# EAGLE design vcu (EAGLE 9.5.2)
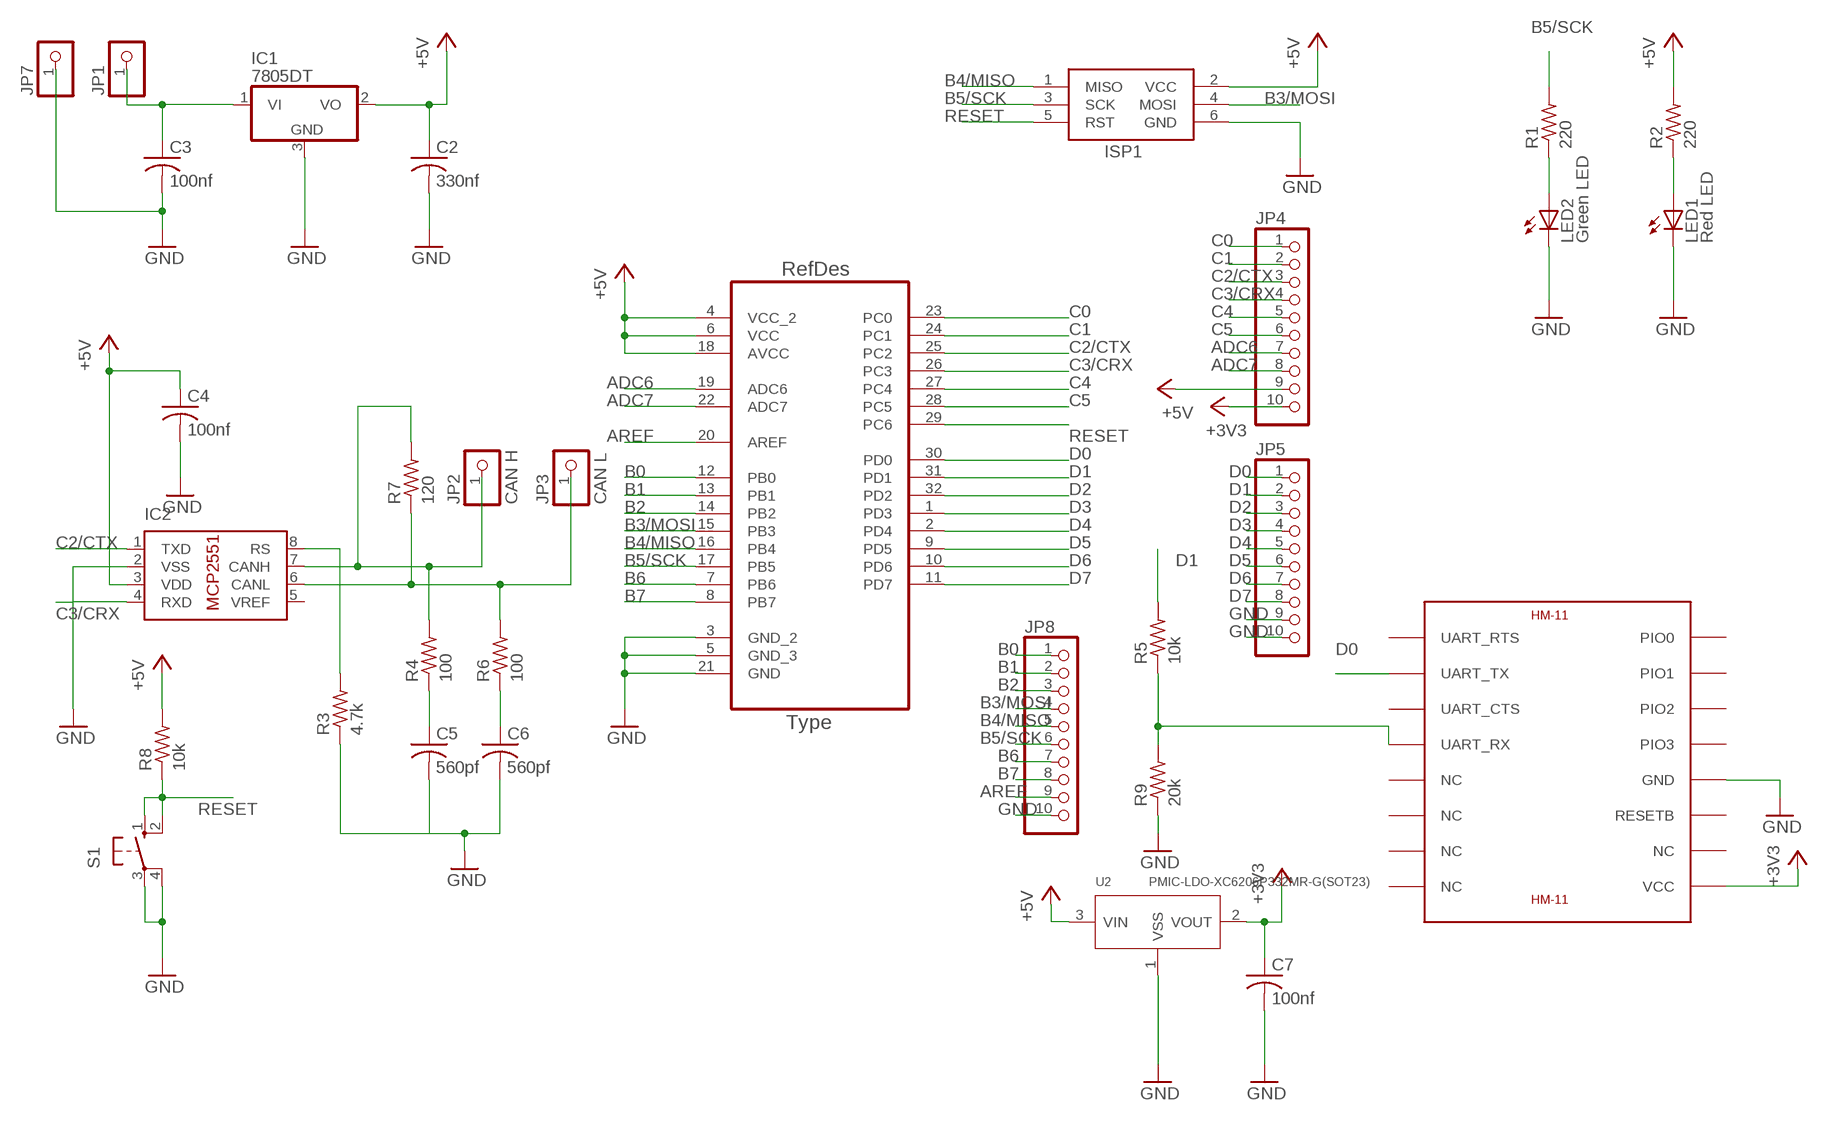
[diagram p0: schematic, sheet 1]

## Parts
C2  330nf  C-USC0402  [C0402]
C3  100nf  C-USC0402  [C0402]
C4  100nf  C-USC0402  [C0402]
C5  560pf  C-USC0402  [C0402]
C6  560pf  C-USC0402  [C0402]
C7  100nf  C-USC0402  [C0402]
IC1  7805DT  [TO252]
IC2  MCP2551/SN  [SO08]
ISP1  AVRISP-6  [AVRISP]
JP1  PINHD-1X1CB  [1X01-CLEANBIG]
JP2  CAN H  PINHD-1X1CB  [1X01-CLEANBIG]
JP3  CAN L  PINHD-1X1CB  [1X01-CLEANBIG]
JP4  PINHD-1X10  [1X10]
JP5  PINHD-1X10  [1X10]
JP7  PINHD-1X1CB  [1X01-CLEANBIG]
JP8  PINHD-1X10  [1X10]
LED1  Red LED  LED0603  [LED-0603]
LED2  Green LED  LED0603  [LED-0603]
R1  220  R-US_M0805  [M0805]
R2  220  R-US_M0805  [M0805]
R3  4.7k  R-US_M0805  [M0805]
R4  100  R-US_M0805  [M0805]
R5  10k  R-US_M0805  [M0805]
R6  100  R-US_M0805  [M0805]
R7  120  R-US_M0805  [M0805]
R8  10k  R-US_M0805  [M0805]
R9  20k  R-US_M0805  [M0805]
S1  10-XX  [B3F-10XX]
U1  ATMEGA328P-AU  [QFP80P900X900X120-32N]
U2  PMIC-LDO-XC6206P332MR-G(SOT23)  [SOT-23]
U$1  HM-11  [HM-11]

## Nets
+3V3: C7.1 JP4.10 U2.2(VOUT) U$1.VCC
+5V: C2.1 C4.1 IC1.2(VO) IC2.3(VDD) ISP1.2(VCC) JP4.9 R2.2 R8.2 U1.4(VCC_2) U1.6(VCC) U1.18(AVCC) U2.3(VIN)
ADC6: JP4.7 U1.19(ADC6)
ADC7: JP4.8 U1.22(ADC7)
AREF: JP8.9 U1.20(AREF)
B0: JP8.1 U1.12(PB0)
B1: JP8.2 U1.13(PB1)
B2: JP8.3 U1.14(PB2)
B3/MOSI: ISP1.4(MOSI) JP8.4 U1.15(PB3)
B4/MISO: ISP1.1(MISO) JP8.5 U1.16(PB4)
B5/SCK: ISP1.3(SCK) JP8.6 R1.2 U1.17(PB5)
B6: JP8.7 U1.7(PB6)
B7: JP8.8 U1.8(PB7)
C0: JP4.1 U1.23(PC0)
C1: JP4.2 U1.24(PC1)
C2/CTX: IC2.1(TXD) JP4.3 U1.25(PC2)
C3/CRX: IC2.4(RXD) JP4.4 U1.26(PC3)
C4: JP4.5 U1.27(PC4)
C5: JP4.6 U1.28(PC5)
D0: JP5.1 U1.30(PD0) U$1.UART_TX
D1: JP5.2 R5.2 U1.31(PD1)
D2: JP5.3 U1.32(PD2)
D3: JP5.4 U1.1(PD3)
D4: JP5.5 U1.2(PD4)
D5: JP5.6 U1.9(PD5)
D6: JP5.7 U1.10(PD6)
D7: JP5.8 U1.11(PD7)
GND: C2.2 C3.2 C4.2 C5.2 C6.2 C7.2 IC1.3(GND) IC2.2(VSS) ISP1.6(GND) JP5.9 JP5.10 JP7.1 JP8.10 LED1.C LED2.C R3.1 R9.1 S1.3(P) S1.4(P1) U1.3(GND_2) U1.5(GND_3) U1.21(GND) U2.1(VSS) U$1.GND
N$2: C3.1 IC1.1(VI) JP1.1
N$3: R5.1 R9.2 U$1.UART_RX
N$8: LED1.A R2.1
N$9: LED2.A R1.1
N$39: IC2.7(CANH) JP2.1 R4.2 R7.2
N$40: IC2.6(CANL) JP3.1 R6.2 R7.1
N$41: C6.1 R6.1
N$42: C5.1 R4.1
N$43: IC2.8(RS) R3.2
RESET: ISP1.5(RST) R8.1 S1.1(S) S1.2(S1) U1.29(PC6)
Unconnected: IC2.5(VREF) U$1.NC@5(NC) U$1.NC@6(NC) U$1.NC@7(NC) U$1.NC@8(NC) U$1.NC@10(NC) U$1.PIO0 U$1.PIO1 U$1.PIO2 U$1.PIO3 U$1.RESETB U$1.UART_CTS U$1.UART_RTS

## Library data of the parts
C2-C7 = adafruit:C-US: CAPACITOR, American symbol
IC1 = linear:78*: Positive VOLTAGE REGULATOR Source: http://cache.national.com/ds/LM/LM78L05.pdf http://www.fairchildsemi.com/ds/LM/LM7805.pdf
IC2 = microchip-dspic:MCP2551: High-Speed CAN Transceiver
ISP1 = adafruit:AVRISP: AVR ISP HEADER Standard 6 pin header for AVR programming
JP1-JP3 JP7 = adafruit:PINHD-1X1: Pin header 1x1 for 0.1" spacing With round pins
JP4 JP5 JP8 = pinhead:PINHD-1X10: PIN HEADER
LED1 LED2 = SparkFun:LED: LEDs Standard schematic elements and footprints for 5mm, 3mm, 1206, and 0603 sized LEDs. 5mm - Spark Fun Electronics SKU : COM-00529 (and others)
R1-R9 = adafruit:R-US_: RESISTOR, American symbol
S1 = switch-omron:10-XX: OMRON SWITCH; MPN: B3F-1000; OC_FARNELL: 176432; OC_NEWARK: 36M3542
U1 = Atmel-ATMEGA328P-AU:ATMEGA328P-AU; DESCRIPTION: 8-bit Microcontroller with In-System Programmable Flash; MPN: ATMEGA328P-AU; OC_FARNELL: 1715486; OC_NEWARK: 14R4631; PACKAGE: TQFP-32; SUPPLIER: Atmel
U2 = PMIC-LDO-XC6206P332MR-G_SOT23_:PMIC-LDO-XC6206P332MR-G(SOT23): 310030099; AVAILABILITY: Unavailable; DESCRIPTION: Linear Voltage Regulator IC 1 Output 200mA SOT-23; MF: Torex; MP: XC6206P332MR-G; PACKAGE: SOT-23-3 Torex; PRICE: None
U$1 = hm-11:HM-11: JNHuaMao HM-11 Bluetooth 4.0 Transceiver based on TI CC2540/CC2541

## Board
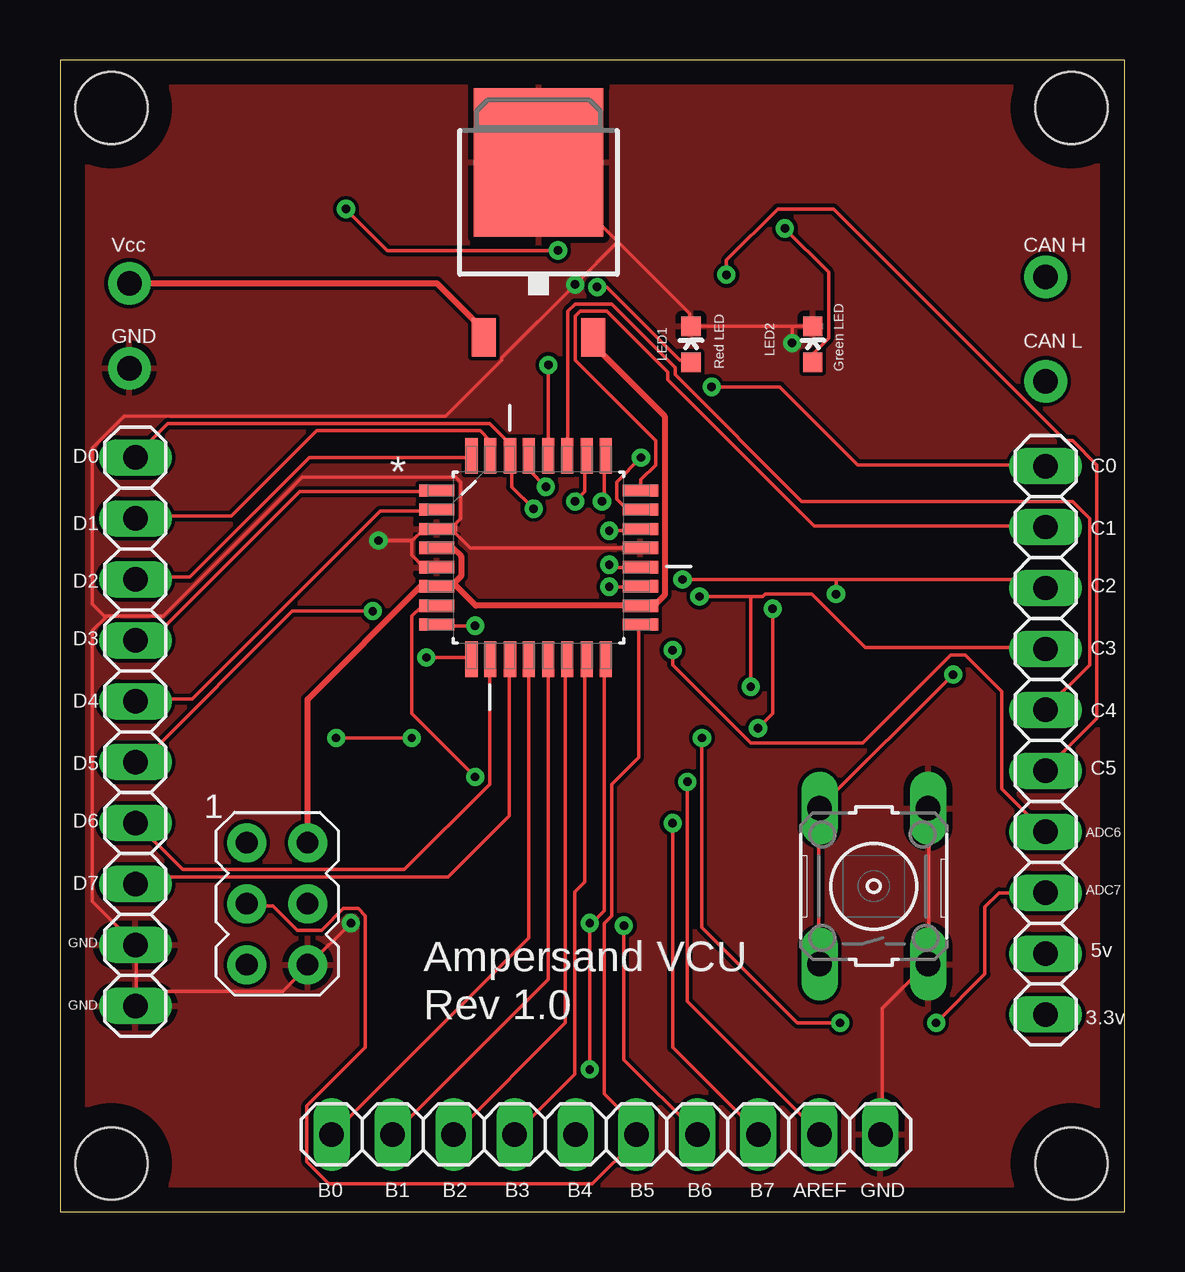
[diagram p1: board, top side]
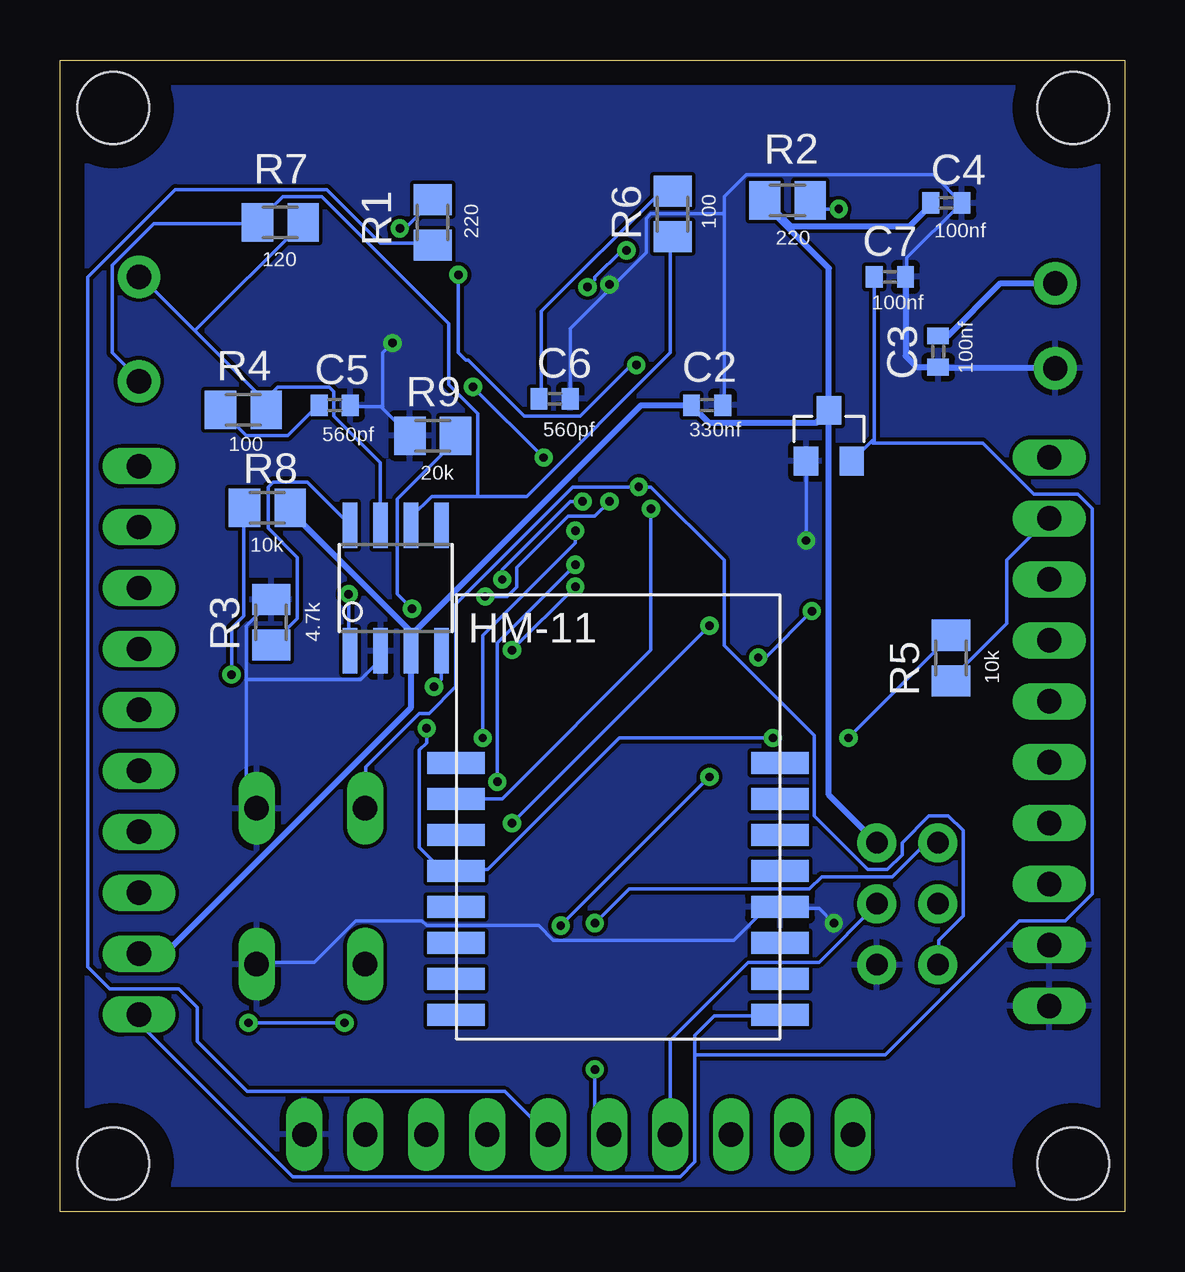
[diagram p2: board, bottom side, seen from below]

Size 44.36 x 48 mm. Coordinates in mm from the lower left corner, seen from the top.
Outline: 0,0 44.36,0 44.36,48 0,48 0,0
Copper layers (1*16): Top 0.035mm / dielectric 1.5mm / Bottom 0.035mm
Design rules "default": minimum track width 6mil, minimum drill 0.35mm, track to track 6mil, track to pad 6mil, pad to pad 6mil, via to via 6mil, smd to smd 6mil, copper to edge 40mil, drill to drill 6mil, minimum pad ring 10mil, minimum via ring 8mil, stop-mask expansion 4mil, vias tented up to drill 0mil, thermal gap 10mil
Holes 3 mm at 2.14,46 42.14,46 42.14,2 2.14,2

### Footprints (pad centres in the part's own frame; a part is rotated, then mirrored left to right if it is on the bottom)
C0402 = smd 0.7 x 0.9: 1 -0.65,0; 2 0.65,0
TO252 = smd 1 x 1.6: 1 -2.28,-4.8; 2 2.28,-4.8 | smd 5.4 x 6.2: 3 0,2.5
SO08 = smd 0.61 x 1.905: 1 -1.905,-2.616; 2 -0.635,-2.616; 3 0.635,-2.616; 4 1.905,-2.616; 5 1.905,2.616; 6 0.635,2.616; 7 -0.635,2.616; 8 -1.905,2.616
AVRISP = drill 0.9 pad 1.626: 1 -1.27,2.54; 2 1.27,2.54; 3 -1.27,0; 4 1.27,0; 5 -1.27,-2.54; 6 1.27,-2.54
1X01-CLEANBIG = drill 1.016 pad 1.778: 1 0,0
1X10 = drill 1.016 long: 1 -11.43,0; 2 -8.89,0; 3 -6.35,0; 4 -3.81,0; 5 -1.27,0; 6 1.27,0; 7 3.81,0; 8 6.35,0; 9 8.89,0; 10 11.43,0
LED-0603 = smd 0.8 x 0.8: A 0,-0.75; C 0,0.75
M0805 = smd 1.3 x 1.6: 1 -0.95,0; 2 0.95,0
B3F-10XX = drill 1.016 long: 1 -3.251,2.261; 2 3.251,2.261; 3 -3.251,-2.261; 4 3.251,-2.261
QFP80P900X900X120-32N = smd 1.473 x 0.508: 1 -4.242,2.794; 2 -4.242,2.007; 3 -4.242,1.194; 4 -4.242,0.406; 5 -4.242,-0.406; 6 -4.242,-1.194; 7 -4.242,-2.007; 8 -4.242,-2.794; 17 4.242,-2.794; 18 4.242,-2.007; 19 4.242,-1.194; 20 4.242,-0.406; 21 4.242,0.406; 22 4.242,1.194; 23 4.242,2.007; 24 4.242,2.794 | smd 0.508 x 1.473: 9 -2.794,-4.242; 10 -2.007,-4.242; 11 -1.194,-4.242; 12 -0.406,-4.242; 13 0.406,-4.242; 14 1.194,-4.242; 15 2.007,-4.242; 16 2.794,-4.242; 25 2.794,4.242; 26 2.007,4.242; 27 1.194,4.242; 28 0.406,4.242; 29 -0.406,4.242; 30 -1.194,4.242; 31 -2.007,4.242; 32 -2.794,4.242
SOT-23 = smd 1.016 x 1.2: 1 -0.95,-1.06; 2 0.95,-1.06; 3 0,1.06
HM-11 = smd 2.4 x 0.9: GND 6.5,0; NC@5 -7,0; NC@6 -7,-1.5; NC@7 -7,-3; NC@8 -7,-4.5; NC@10 6.5,-3; PIO0 6.5,6; PIO1 6.5,4.5; PIO2 6.5,3; PIO3 6.5,1.5; RESETB 6.5,-1.5; UART_CTS -7,3; UART_RTS -7,6; UART_RX -7,1.5; UART_TX -7,4.5; VCC 6.5,-4.5

### Placement (x,y rotation side)
C2  17.4,33.61 0 bottom
C3  7.77,35.85 270 bottom
C4  7.43,42.04 0 bottom
C5  32.91,33.61 0 bottom
C6  23.75,33.88 0 bottom
C7  9.78,38.96 0 bottom
IC1  19.94,41.23 0 top
IC2  30.37,25.99 0 bottom
ISP1  9.05,12.83 0 top
JP1  2.89,38.69 0 top
JP2  41.07,38.96 0 top
JP3  41.07,34.61 0 top
JP4  41.07,19.64 270 top
JP5  3.14,20 270 top
JP7  2.89,35.15 0 top
JP8  22.75,3.21 0 top
LED1  26.29,36.15 0 top
LED2  31.37,36.15 0 top
R1  28.83,41.23 270 bottom
R2  14.05,42.15 180 bottom
R3  35.56,24.56 270 bottom
R4  36.72,33.42 0 bottom
R5  7.24,23.07 270 bottom
R6  18.83,41.58 270 bottom
R7  35.18,41.23 0 bottom
R8  35.72,29.34 0 bottom
R9  28.83,32.34 0 bottom
S1  33.91,13.56 90 top
U1  19.94,27.26 0 top
U2  12.32,32.34 0 bottom
U$1  20.86,12.7 0 bottom

### Tracks (layer width: path | path; a pad name or v marks a point on that pad's centre or on a via)
+3V3
  Bottom 0.152: 17.91,6.53 17.91,2.06 18.52,1.45 34.67,1.45 40.97,7.75 40.97,8.16 JP4.10 | 17.91,6.53 17.91,7.35 17.09,8.16 14.45,8.16 U$1.VCC | 10.49,32.03 5.92,32.03 3.79,29.9 1.96,29.9 1.35,29.29 1.35,13.24 2.47,12.12 4.4,12.12 9.98,6.53 17.91,6.53 | 10.49,32.03 10.54,32.09 10.49,32.14 10.51,32.14 U2.2 | C7.1 10.43,32.1 10.49,32.03
+5V
  Top 0.254: ISP1.2 10.32,21.35 15.04,26.07 U1.6 | U1.6 16.52,26.07 17.33,25.25 U1.18 24.76,25.25 25.2,25.7 25.2,33.15 22.22,36.13 IC1.2 | U1.4 16.36,27.67 16.71,27.31 16.71,26.48 16.3,26.07 U1.6
  Bottom 0.254: IC2.3 29.73,24.02 20.15,33.61 C2.1 17.32,32.88 12.84,32.88 U2.3 | JP4.9 40,10.75 29.73,21.01 IC2.3 | IC2.3 29.73,24.16 34.77,29.19 R8.2 | U2.3 12.32,39.32 15,42 R2.2 13.92,41.07 8.95,41.07 8.08,41.94 C4.1 | ISP1.2 12.32,17.37 U2.3
ADC6  (via drill 0.35)
  Top 0.152: v22.89,26.04 24.11,26.04 U1.19 | v25.53,23.4 25.53,22.79 28.78,19.54 33.45,19.54 37.11,23.2 37.72,23.2 39.24,21.67 39.24,17.61 40.97,15.88 JP4.7
  Bottom 0.152: v25.53,23.4 v22.89,26.04
ADC7  (via drill 0.35)
  Top 0.152: v22.89,28.38 24.11,28.38 U1.22 | v26.75,19.74 26.75,11.84 30.72,7.86 v32.5,7.86 | JP4.8 39.13,13.29 38.54,12.7 38.54,9.9 v36.5,7.86
  Bottom 0.152: v22.89,28.38 22.89,27.87 26.75,24.01 v26.75,19.74 | v32.5,7.86 v36.5,7.86
AREF  (via drill 0.35)
  Top 0.152: U1.20 22.99,26.85 v22.89,26.95 | v26.14,17.91 26.14,8.77 31.62,3.28 JP8.9
  Bottom 0.152: v22.89,26.95 26.14,23.7 v26.14,17.91
B0
  Top 0.152: U1.12 19.53,11.41 11.41,3.28 JP8.1
B1
  Top 0.152: U1.13 20.35,9.68 13.95,3.28 JP8.2
B2
  Top 0.152: U1.14 21.06,22.99 21.06,7.85 16.49,3.28 JP8.3
B3/MOSI
  Top 0.152: U1.15 21.87,22.99 21.87,13.75 21.44,13.32 21.44,5.71 JP8.4
  Bottom 0.152: ISP1.4 10.39,12.73 12.73,10.39 15.67,10.39 18.92,7.14 18.92,3.28 JP8.4
B4/MISO  (via drill 0.35)
  Top 0.152: 22.12,11.97 22.07,11.92 v22.07,5.92 | 22.12,11.97 22.68,12.53 22.68,22.99 U1.16 | v22.07,12.02 22.12,11.97
  Bottom 0.152: v22.07,5.92 22.07,3.79 21.57,3.28 JP8.5 | v22.07,12.02 20.65,13.44 13.13,13.44 12.62,13.95 9.68,13.95 8.36,15.27 7.85,15.27 ISP1.1
B5/SCK
  Top 0.152: U1.17 24.11,24.41 24.11,18.93 22.99,17.81 22.99,12.33 22.68,12.02 22.68,4.91 24,3.59 24,3.28 JP8.6 24,3.18 24,2.98 22.17,1.15 11.2,1.15 10.29,2.06 10.29,4.4 12.73,6.84 12.73,12.33 12.42,12.63 11.81,12.63 10.9,11.72 9.88,11.72 8.87,12.73 7.85,12.73 ISP1.3
  Bottom 0.152: R1.2 28.88,40.37 31.01,40.37 33.25,42.6 39.55,42.6 43.21,38.94 43.21,10.19 42.29,9.28 39.41,9.28 38.64,8.5 38.64,7.1 36.55,5.01 25.83,5.01 24.11,3.28 JP8.6
B6  (via drill 0.35)
  Top 0.152: v17.3,18.12 14.66,20.76 14.66,24.82 15.06,25.23 15.67,25.23 U1.7 | v23.5,11.92 23.5,6.33 26.54,3.28 JP8.7
  Bottom 0.152: v23.5,11.92 v17.3,18.12
B7  (via drill 0.35)
  Top 0.152: v17.3,24.41 15.77,24.41 U1.8 | v25.53,16.19 25.53,6.84 29.08,3.28 JP8.8
  Bottom 0.152: v25.53,16.19 v17.3,24.41
C0  (via drill 0.35)
  Top 0.152: v24.21,31.43 23.19,30.41 23.19,29.7 23.6,29.29 24.11,29.29 U1.23 | v27.15,34.37 30,34.37 33.25,31.12 40.97,31.12 JP4.1
  Bottom 0.152: v27.15,34.37 v24.21,31.43
C1
  Top 0.152: U1.24 24.21,30.1 24.21,30.51 24.82,31.12 24.82,32.14 21.46,35.49 21.46,37.32 21.67,37.52 22.79,37.52 25.33,34.98 25.33,34.68 31.42,28.58 40.97,28.58 JP4.2
C2/CTX  (via drill 0.35)
  Top 0.152: v22.58,29.6 22.68,29.7 22.68,31.43 U1.25 | 32.34,26.35 40.67,26.35 40.97,26.04 JP4.3 | 32.34,26.35 v25.93,26.35 | 32.34,26.35 v32.34,25.74
  Bottom 0.152: v22.58,29.6 23.09,29.6 25.93,26.75 v25.93,26.35 | v32.34,25.74 32.34,23.4 IC2.1
C3/CRX  (via drill 0.35)
  Top 0.152: v21.46,29.6 21.87,30 21.87,31.43 U1.26 | 28.78,25.63 29.29,25.63 29.39,25.74 31.32,25.74 33.55,23.5 40.97,23.5 JP4.4 | 28.78,25.63 v26.65,25.63 | 28.78,25.63 v28.78,21.88
  Bottom 0.152: v21.46,29.6 22.07,28.99 23.19,28.99 25.33,26.85 25.33,26.04 25.73,25.63 v26.65,25.63 | v28.78,21.88 28.47,22.18 28.47,23.3 IC2.4
C4
  Top 0.152: U1.27 21.16,31.53 21.16,37.52 21.46,37.83 22.99,37.83 25.63,35.19 25.63,34.88 30.91,29.6 42.19,29.6 42.9,28.89 42.9,22.79 41.07,20.96 JP4.5
C5  (via drill 0.35)
  Top 0.152: v20.35,35.29 U1.28 | v27.76,39.05 27.76,39.66 29.9,41.79 32.23,41.79 41.89,32.14 42.19,32.14 43.21,31.12 43.21,20.55 41.07,18.42 JP4.6
  Bottom 0.152: v20.35,35.29 20.55,35.29 22.68,33.15 25.02,33.15 27.36,35.49 27.46,35.49 27.76,35.79 v27.76,39.05
D0  (via drill 0.35)
  Top 0.152: JP5.1 3.18,31.53 4.5,32.85 17.91,32.85 18.72,32.03 18.72,31.53 U1.30 18.82,31.43 18.82,30.21 v19.74,29.29
  Bottom 0.152: v19.74,29.29 19.74,23.4 25.93,17.2 27.76,17.2 U$1.UART_TX
D1
  Top 0.152: JP5.2 3.18,28.99 7.14,28.99 10.69,32.54 17.5,32.54 17.93,32.11 U1.31
  Bottom 0.152: R5.2 7.24,22.18 4.9,24.52 4.9,27.16 3.18,28.89 JP5.2
D2
  Top 0.152: U1.32 17.09,31.43 10.39,31.43 5.41,26.45 3.18,26.45 JP5.3
D3
  Top 0.152: U1.1 15.67,30 9.98,30 3.89,23.91 3.18,23.91 JP5.4
D4
  Top 0.152: U1.2 15.67,29.19 13.34,29.19 5.51,21.37 3.18,21.37 JP5.5
D5  (via drill 0.35)
  Top 0.152: v15.27,23.09 17.09,23.09 U1.9 | v13.03,25.02 9.68,25.02 3.48,18.83 3.18,18.83 JP5.6
  Bottom 0.152: v15.27,23.09 14.96,23.09 v13.03,25.02
D6
  Top 0.152: U1.10 17.91,22.99 17.91,17.81 14.35,14.26 5.11,14.26 3.18,16.19 JP5.7
D7
  Top 0.152: U1.11 18.72,22.99 18.72,16.49 16.18,13.95 3.38,13.95 3.18,13.75 JP5.8
GND  (via drill 0.35)
  Top 0.152: 30.51,36.91 31.32,36.91 LED2.C | 30.51,36.91 26.34,36.91 LED1.C 26.24,36.91 26.24,37.42 23.24,40.42 | 23.24,40.42 19.94,43.72 IC1.3 | 30.51,36.91 v30.51,36.2 | 23.24,40.42 v21.46,38.64 18.42,35.59 18.42,35.49 16.08,33.15 2.67,33.15 1.35,31.83 1.35,25.33 1.91,24.77 | JP8.10 34.27,3.28 34.27,8.46 36.09,10.29 S1.3 36.2,10.39 36.2,16.8 S1.4 | U1.5 15.16,26.85 14.66,27.36 14.66,27.94 | U1.21 17.09,27.67 16.44,28.33 | 16.44,28.33 16.38,28.38 15.77,28.38 U1.3 15.17,28.45 14.66,27.94 | 3.18,9.18 3.18,11.11 JP5.9 3.07,11.21 1.35,12.93 1.35,24.21 1.91,24.77 | 3.18,9.18 3.18,8.67 JP5.10 3.18,9.18 | v12.12,12.02 10.39,10.29 ISP1.6 10.29,10.19 9.27,9.18 3.18,9.18 | 1.91,24.77 1.96,24.82 4.29,24.82 10.09,30.61 16.49,30.61 16.69,30.41 16.69,28.89 16.49,28.68 16.49,28.38 16.44,28.33 | v13.27,27.97 14.63,27.97 14.66,27.94
  Bottom 0.152: 16.69,41.59 16.69,42.3 15.77,43.21 7.95,43.21 C4.2 6.83,41.99 9.07,39.76 9.07,39.05 C7.2 | 16.69,41.59 16.69,33.66 C2.2 | 21.41,38.49 19.94,39.96 19.94,41.38 19.74,41.59 16.69,41.59 | 21.41,38.49 23.09,36.81 23.09,33.97 C6.2 | 30.96,33.51 29.8,32.34 R9.1 | 30.96,33.51 31.01,33.56 32.23,33.56 C5.2 | v30.51,36.2 30.91,35.79 30.91,33.56 30.96,33.51 | v21.46,38.64 21.46,38.54 21.41,38.49 | 36.6,22.18 36.6,17.3 36.2,16.9 S1.4 | 36.6,22.18 36.6,24.41 35.59,25.43 R3.1 | 36.6,22.18 31.83,22.18 31.01,22.99 31.01,23.3 IC2.2 | v12.12,12.02 12.73,12.63 14.35,12.63 U$1.GND 14.45,12.63 14.96,12.63 16.28,11.31 23.8,11.31 24.41,11.92 29.08,11.92 29.29,12.12 32.03,12.12 33.76,10.39 36.09,10.39 S1.3 | U2.1 v13.27,27.97
  Bottom 0.254: JP7.1 7.72,35.15 C3.2 8.67,35.2 9.13,35.66 C7.2
  pour Top: 0.14,48 44.14,48 44.14,0 0.14,0
  pour Bottom: 0.14,48 44.14,48 44.14,0 0.14,0
N$2
  Top 0.254: IC1.1 17.66,36.73 15.7,38.69 JP1.1
  Bottom 0.254: JP1.1 5.18,38.69 7.37,36.5 C3.1
N$3  (via drill 0.35)
  Top 0.152: v14.66,19.74 v11.51,19.74 | v29.69,25.13 29.69,20.76 v29.08,20.15
  Bottom 0.152: v11.51,19.74 R5.1 | v14.66,19.74 21.06,19.74 26.54,14.26 27.76,14.26 U$1.UART_RX 27.87,14.26 28.47,14.26 29.39,15.17 29.39,19.23 29.08,19.54 v29.08,20.15 | v29.69,25.13 30.3,25.74 30.3,29.7 27.97,32.03 27.97,32.34 R9.2
N$8  (via drill 0.35)
  Top 0.152: v22.38,38.54 22.79,38.54 25.83,35.49 26.24,35.49 LED1.A | v20.75,40.06 13.64,40.06 v11.91,41.79
  Bottom 0.152: v22.38,38.54 22.07,38.84 22.07,38.94 20.96,40.06 v20.75,40.06 | v11.91,41.79 12.73,41.79 13.03,42.09 R2.1
N$9  (via drill 0.35)
  Top 0.152: v30.2,40.98 32.03,39.15 32.03,36.4 31.42,35.79 31.42,35.49 LED2.A
  Bottom 0.152: v30.2,40.98 30,40.98 28.88,42.09 R1.1
N$39
  Bottom 0.152: 38.74,36.71 40.97,38.94 JP2.1 | 38.74,36.71 35.79,33.76 35.79,33.46 R4.2 35.79,33.86 35.28,34.37 33.15,34.37 32.95,34.17 32.95,33.15 31.01,31.22 31.01,28.68 IC2.7 | 38.74,36.71 34.27,41.18 R7.2
N$40
  Bottom 0.152: JP3.1 41.07,34.68 42.19,35.79 42.19,39.45 40.46,41.18 36.2,41.18 R7.1 36.09,41.28 35.08,42.3 33.45,42.3 28.17,37.01 28.17,34.47 26.95,33.25 26.95,29.8 | 26.95,29.8 28.88,29.8 29.69,28.99 29.69,28.68 IC2.6 | 26.95,29.8 24.92,29.8 18.92,35.79 18.92,40.57 R6.2
N$41
  Bottom 0.152: C6.1 24.31,33.97 24.31,37.52 19.33,42.5 18.92,42.5 R6.1
N$42
  Bottom 0.152: C5.1 33.66,33.56 34.88,32.34 36.6,32.34 37.62,33.36 R4.1
N$43
  Bottom 0.152: R3.2 35.48,23.7 34.47,24.72 34.47,27.26 35.69,28.48 35.69,30.21 35.48,30.41 34.06,30.41 32.34,28.68 IC2.8
RESET  (via drill 0.35)
  Top 0.152: U1.29 19.53,30.92 v20.24,30.21 | v37.21,22.38 31.73,16.9 S1.2 31.62,16.8 31.62,10.39 S1.1
  Bottom 0.152: S1.2 31.62,16.9 31.62,18.52 29.39,20.76 28.98,20.76 27.87,21.88 27.87,25.33 22.99,30.21 v20.24,30.21 19.74,30.21 16.69,27.16 16.69,23.6 12.93,19.84 12.93,16.49 10.69,14.26 9.88,14.26 9.27,14.87 9.27,15.37 8.15,16.49 7.34,16.49 6.73,15.88 6.73,12.33 7.75,11.31 7.75,10.29 ISP1.5 | v37.21,22.38 37.21,24.31 36.7,24.82 36.7,29.29 R8.1

### Text on the board
tNames: Vcc | CAN H | GND | CAN L | D0 | C0 | D1 | C1 | D2 | C2 | D3 | C3 | D4 | C4 | D5 | C5 | D6 | ADC6 | D7 | ADC7 | GND | 5v | Ampersand VCU | GND | Rev 1.0 | 3.3v | B0 | B1 | B2 | B3 | B4 | B5 | B6 | B7 | AREF | GND
bNames: 100 | 220 | 100nf | 220 | 120 | 100nf | 100nf | 330nf | 560pf | 560pf | 100 | 20k | 10k | 4.7k | 10k